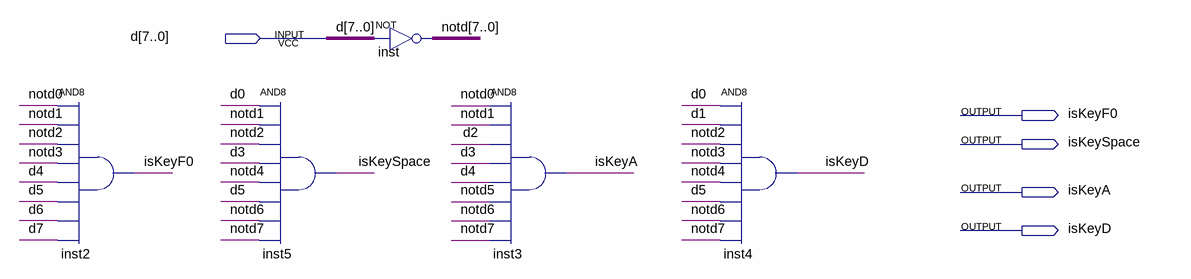
[diagram p0: schematic sheet]
// Quartus schematic KeyDetector.bdf as structural Verilog: 5 symbols, 5 pins
module KeyDetector (
  input  [7:0] d,
  output isKeyF0,
  output isKeySpace,
  output isKeyA,
  output isKeyD
);

  wire [7:0] notd;

  and inst2 (isKeyF0, notd[0], notd[1], notd[2], notd[3], d[4], d[5], d[6], d[7]);
  and inst5 (isKeySpace, d[0], notd[1], notd[2], d[3], notd[4], d[5], notd[6], notd[7]);
  assign notd = ~d;  // NOT inst, 8 bits wide
  and inst3 (isKeyA, notd[0], notd[1], d[2], d[3], d[4], notd[5], notd[6], notd[7]);
  and inst4 (isKeyD, d[0], d[1], notd[2], notd[3], notd[4], d[5], notd[6], notd[7]);
endmodule
